# EAGLE design thefinger (EAGLE 9.1.1)
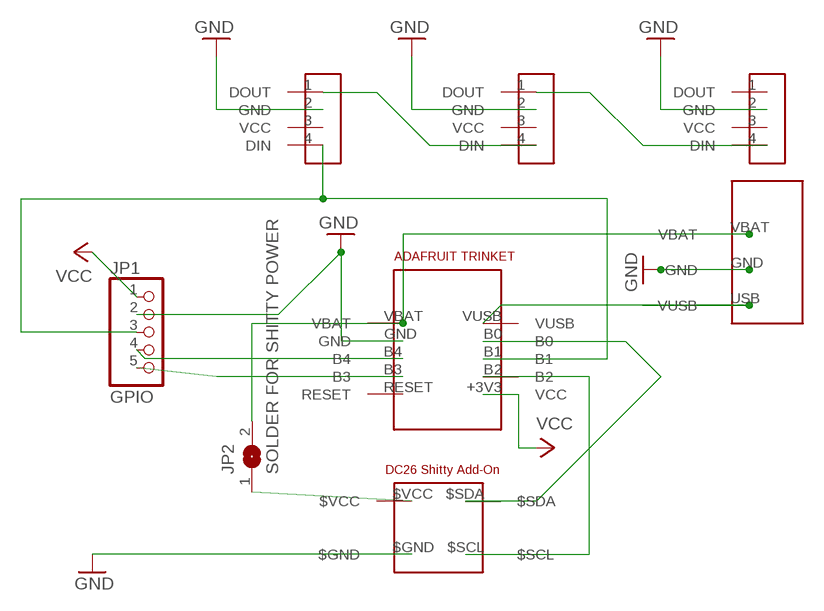
[diagram p0: schematic, sheet 1]

## Parts
JP1  GPIO  PINHD-1X5  [1X05]
JP2  SOLDER FOR SHITTY POWER  SJW  [SJW]
U$1  NEOPIXEL5MMRGB  [NEOPIXEL5MMRGB]
U$2  NEOPIXEL5MMRGB  [NEOPIXEL5MMRGB]
U$3  SHITTYADDON  [SHITTYADDON]
U$4  NEOPIXEL5MMRGB  [NEOPIXEL5MMRGB]
U$5  ADAFRUIT_TRINKET_3V  [ADAFRUIT_TRINKET_3V_MICROUSB]
U$6  LIPOPACK  [LIPOPACK]

## Nets
$VCC: JP2.1 U$3.$VCC
GND: JP1.2 U$1.2(GND) U$2.2(GND) U$3.$GND U$4.2(GND) U$5.GND U$6.GND
N$1: U$3.$SDA U$5.B0
N$2: JP1.5 U$5.B3
N$4: JP1.3 U$1.4(DIN) U$5.B1
N$5: U$1.1(DOUT) U$2.4(DIN)
N$6: U$2.1(DOUT) U$4.4(DIN)
N$9: U$3.$SCL U$5.B2
S$1: JP1.4 U$5.B4
VBAT: JP2.2 U$5.VBAT U$6.VBAT
VCC: JP1.1 U$5.+3V3(VCC)
VUSB: U$5.VUSB U$6.USB(VUSB)
Unconnected: U$4.1(DOUT) U$5.RESET

## Power pins joined to a net without a drawn wire
VCC: U$1.3(VCC) U$2.3(VCC) U$4.3(VCC)

## Library data of the parts
JP1 = pinhead:PINHD-1X5: PIN HEADER
JP2 = jumper:SJ: SMD solder JUMPER
U$1 U$2 U$4 = adafruit-boards:NEOPIXEL5MMRGB
U$3 = shitty defcon add-on:SHITTYADDON: It's a shitty DEFCON26 Add-on Connector! it's a shitty little library for the shitty DEFCON add-on connector, originally from Brian B. link below. simple 3.3volt I2C connecto in a 2x2 .1inch 2.54mm spacing. align VCC to the target. can you hit a target? https://hackaday.io/benchoff
U$5 = adafruit-boards:ADAFRUIT_TRINKET_3V: Adafruit trinket 3v microusb
U$6 = adafruit-boards:LIPOPACK

## Module TEST
Ports: 

### Library data of the parts

## Net classes
0 default: clearance 0.205 mm

## Board
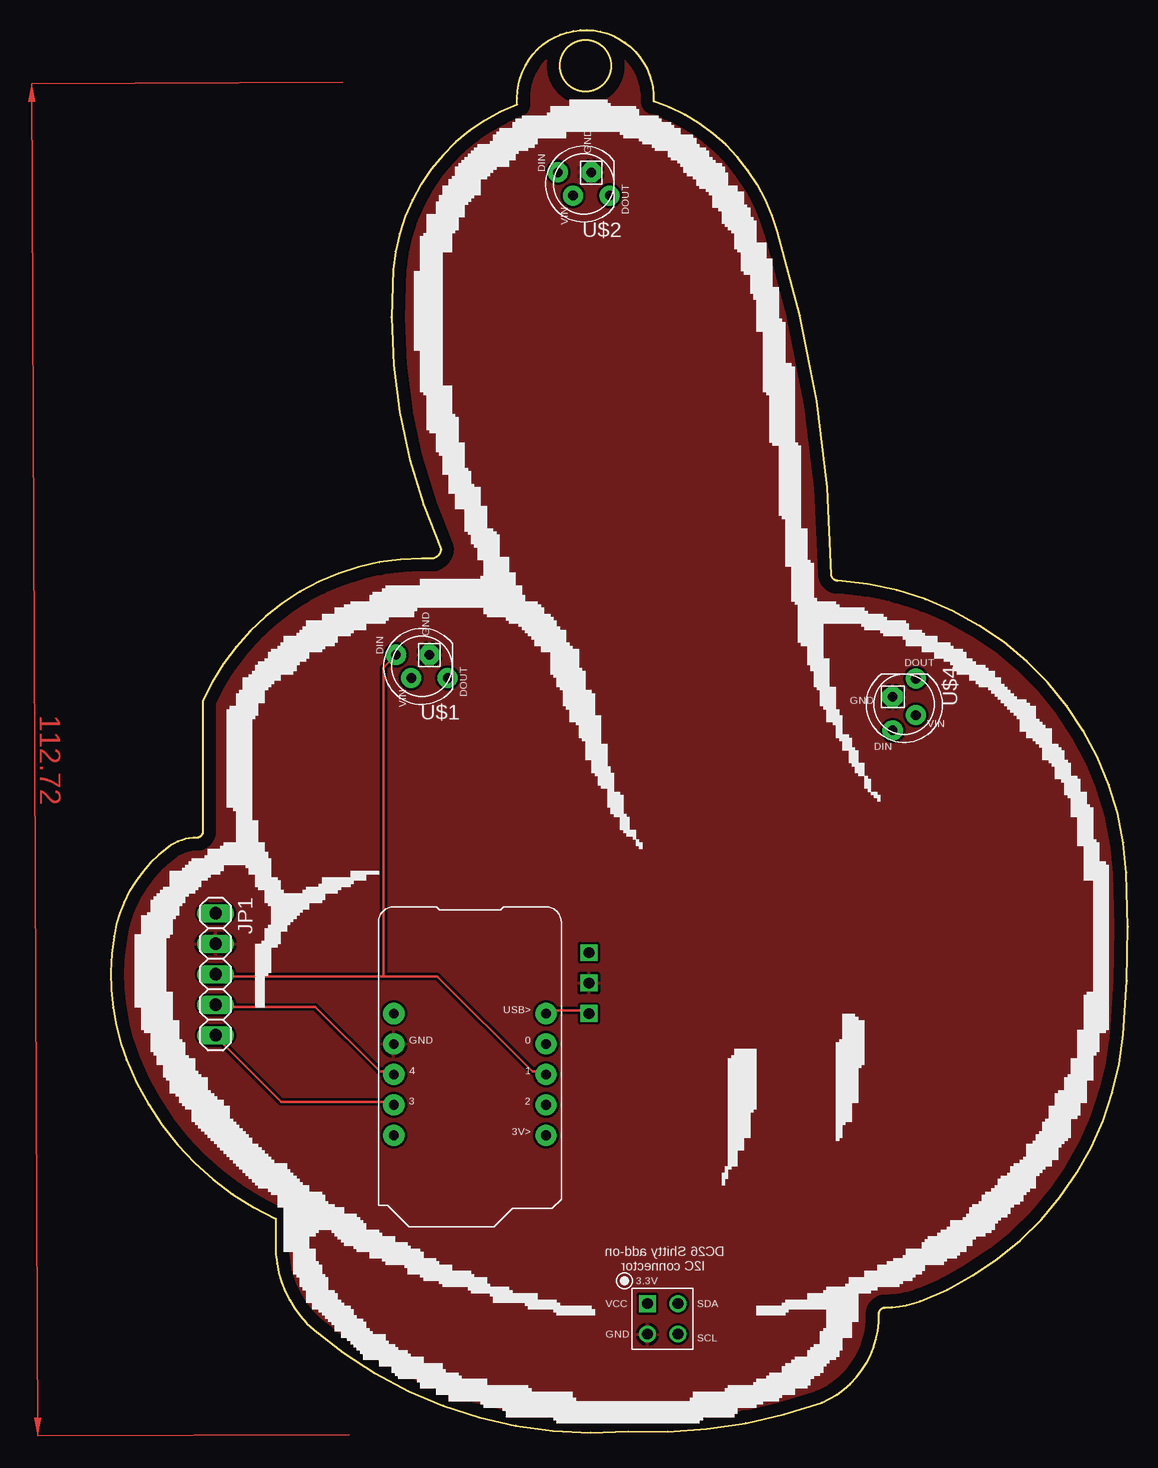
[diagram p1: board, top side]
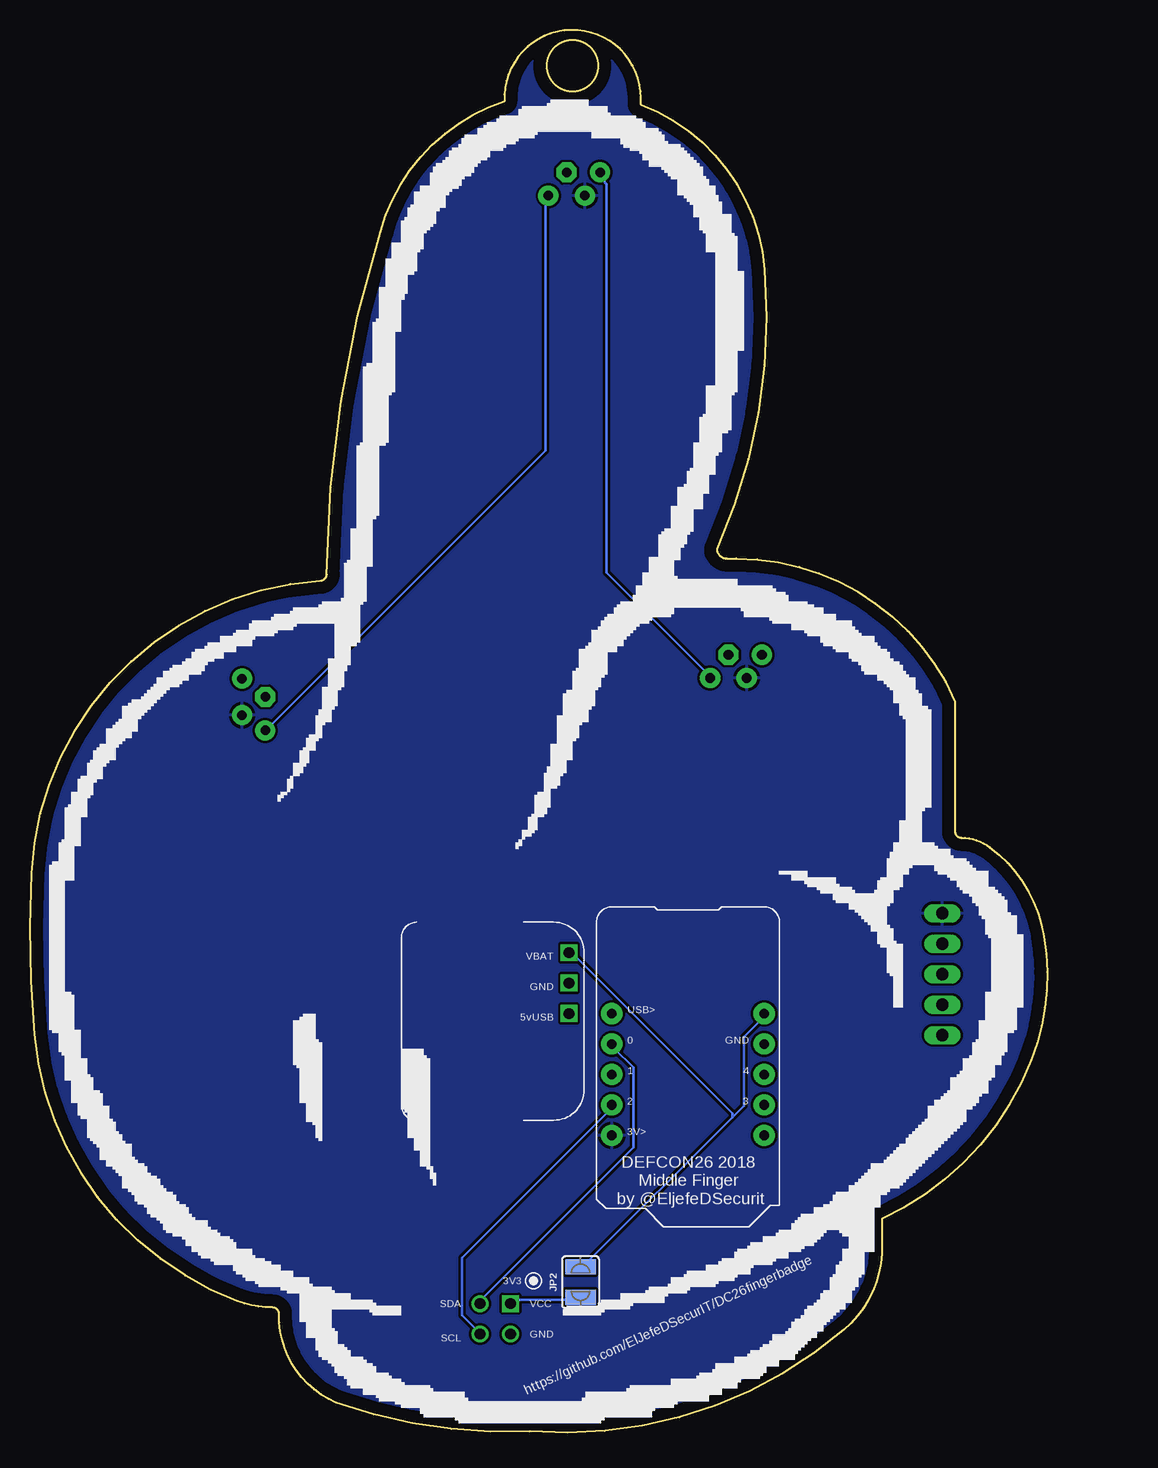
[diagram p2: board, bottom side, seen from below]

Size 84.79 x 116.94 mm. Coordinates in mm from the lower left corner, seen from the top.
Outline: 13.76,17.84 13.76,14.93 arc46 16.93,8.58 arc45 43.13,0.12 arc22 59.27,2.5 arc68 64.03,9.91 arc-90 64.56,10.44 arc21 67.47,10.97 arc64 84.4,33.19 arc8 84.67,46.69 arc83 60.59,71.03 arc-90 60.06,71.56 arc17 55.56,100.13 arc57 45.24,110.98 arc183 33.87,111.25 33.87,110.72 arc65 23.55,96.96 arc28 27.52,73.67 arc-90 26.72,72.88 25.93,72.88 arc66 7.67,60.97 7.67,50.13 arc-90 7.14,49.6 arc37 4.76,48.8 arc44 0.26,41.39 arc31 1.32,31.07 arc44 13.76,17.84
Outline: circle at 39.58,113.94 radius 2.13
Copper layers (1*16): Top 0.035mm / dielectric 2mm / Bottom 0.035mm
Design rules "thefinger *": minimum track width 0.2mm, minimum drill 0.35mm, track to track 0.205mm, track to pad 0.205mm, pad to pad 0.205mm, via to via 0.205mm, smd to smd 0.205mm, copper to edge 40mil, drill to drill 0.2mm, minimum pad ring 10mil, minimum via ring 8mil, stop-mask expansion 4mil, vias tented up to drill 0mil, thermal gap 10mil

### Footprints (pad centres in the part's own frame; a part is rotated, then mirrored left to right if it is on the bottom)
1X05 = drill 1.016 long: 1 -5.08,0; 2 -2.54,0; 3 0,0; 4 2.54,0; 5 5.08,0
SJW = smd 1.27 x 2.54: 1 -1.27,0; 2 1.27,0
NEOPIXEL5MMRGB = drill 0.8 pad 1.676: 1 -2.159,0.968; 3 0.889,0.968; 4 2.159,-0.968 | drill 0.8 pad 1.676 octagon: 2 -0.635,-0.968
SHITTYADDON = drill 0.9: $GND 0,0; $SCL 2.54,0; $SDA 2.54,2.54 | drill 0.9 square: $VCC 0,2.54
ADAFRUIT_TRINKET_3V_MICROUSB = drill 0.8 pad 1.778: +3V3 6.35,-6.35; B0 6.35,1.27; B1 6.35,-1.27; B2 6.35,-3.81; B3 -6.35,-3.81; B4 -6.35,-1.27; GND -6.35,1.27; RESET -6.35,-6.35; VBAT -6.35,3.81; VUSB 6.35,3.81
LIPOPACK = drill 0.9 square: GND 2.54,13.97; USB 5.08,13.97; VBAT 0,13.97

### Placement (x,y rotation side)
JP1  8.73,38.22 270 top
JP2  38.89,12.55 90 bottom
U$1  25.93,63.88 180 top
U$2  39.42,104.1 180 top
U$3  44.73,8.22 0 top
U$4  66.15,60.71 270 top
U$5  29.93,31.14 0 top
U$6  53.83,40.02 270 bottom

### Tracks (layer width: path | path; a pad name or v marks a point on that pad's centre or on a via)
$VCC
  Bottom 0.2: JP2.1 38.94,11.07 44.66,11.07 U$3.$VCC
GND
  pour Top: 22.75,76.58 22.75,112.57 36.09,116.16 38.63,118.7 41.17,118.7 47.3,112.57 59.53,112.57 60.59,112.57 60.59,71.29 85.2,71.29 85.2,-0.41 0,-0.41 0,73.41 22.75,73.41
N$1
  Bottom 0.2: U$3.$SDA 47.2,11.07 34.5,23.77 34.5,30.44 36.09,32.03 36.09,32.34 U$5.B0
N$2
  Top 0.2: JP1.5 8.78,32.98 14.18,27.58 23.39,27.58 U$5.B3
N$4
  Top 0.2: 22.75,38.06 27.2,38.06 35.14,30.12 36.09,30.12 U$5.B1 | 22.75,38.06 8.78,38.06 JP1.3 | 22.75,38.06 22.75,63.78 23.7,64.73 U$1.4
N$5
  Bottom 0.2: U$1.1 28.15,63.14 36.72,71.71 36.72,104.1 37.04,104.42 37.04,105.05 U$2.4
N$6
  Bottom 0.2: U$4.4 64.98,58.7 41.8,81.87 41.8,102.83 U$2.1
N$9
  Bottom 0.2: U$3.$SCL 47.52,8.53 48.79,9.8 48.79,14.56 36.4,26.95 36.4,27.26 U$5.B2
S$1
  Top 0.2: JP1.4 8.78,35.52 17.04,35.52 22.43,30.12 23.39,30.12 U$5.B4
VBAT
  Bottom 0.2: 26.25,26.31 25.29,27.26 25.29,32.98 23.7,34.57 23.7,34.88 U$5.VBAT | 26.25,26.31 38.63,13.93 JP2.2 | 26.25,26.31 26.25,26.63 39.58,39.96 U$6.VBAT
VCC
  pour Bottom: 24.34,75.26 21.79,83.43 arc-76 33.81,115.69 arc-106 55.62,107.21 arc-9 62.44,73.41 63.77,73.41 arc-59 80.17,64.15 arc-52 83.87,23.93 arc-56 66.41,8.58 arc83 65.09,6.73 arc-62 62.44,1.18 arc-192
VUSB
  Top 0.2: U$6.USB 39.58,35.2 36.4,35.2 U$5.VUSB
(copper drawn outside any net)
  shapes: Top area x1

### Text on the board
bPlace: DEFCON26 2018 / Middle Finger / by @EljefeDSecurit | https://github.com/ElJefeDSecurIT/DC26fingerbadge